# Altium schematic sheet Э4.SchDoc
size A3
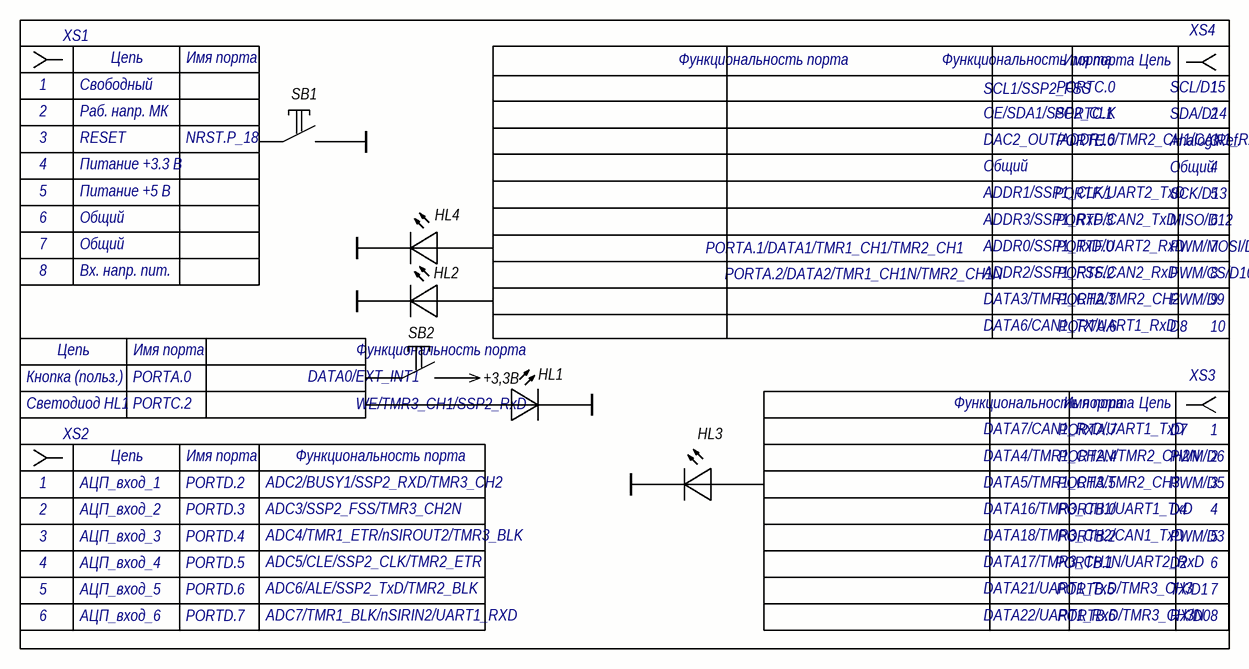
[diagram p0: Э4.SchDoc]

## Parts
(Parts that share a designator on the sheet are numbered #1, #2 ... from top to bottom, then left to right.)
HL1  Светодиод  [DIODE: LED3MM_G]  (value not drawn)
HL2  Светодиод  [DIODE: LED3MM_G]  (value not drawn)
HL3  Светодиод  [DIODE: LED3MM_G]  (value not drawn)
HL4  Светодиод  [DIODE: LED3MM_G]  (value not drawn)
SB?#1  Переключатель  [BUT: 6x6 SMD]  (value not drawn)  (part A of 2)
SB?#2  Переключатель  [BUT: 6x6 SMD]  (value not drawn)  (part A of 2)

## Nets
+3,3В: SB?#2.2
GND: HL1.K HL2.K HL3.K HL4.K SB?#1.2

Not connected (* = marked no-connect by the designer): HL1 A; HL2 A; HL3 A; HL4 A; SB?#1 1; SB?#2 1

## Notes on the sheet
- 1
- XS1
- Свободный
- Цепь
- Имя порта
- (near SB?#1) SB1
- Функциональность порта
- SCL1/SSP2_FSS
- PORTC.0
- SCL/D15
- XS4
- 2
- 3
- Раб. напр. МК
- RESET
- (near SB?#1) NRST.P_18
- OE/SDA1/SSP2_CLK
- DAC2_OUT/ADDR16/TMR2_CH1/CAN1_RхD
- PORTC.1
- PORTE.0
- SDA/D14
- Analog Ref.
- 4
- 5
- 6
- Питание +3.3 В
- Питание +5 В
- Общий
- ADDR1/SSP1_CLK/UART2_TxD
- ADDR3/SSP1_RxD/CAN2_TxD
- PORTF.1
- PORTF.3
- SCK/D13
- MISO/D12
- 7
- 8
- Вх. напр. пит.
- (near HL4) PORTA.1/DATA1/TMR1_CH1/TMR2_CH1
- PORTA.2/DATA2/TMR1_CH1N/TMR2_CH1N
- ADDR0/SSP1_TxD/UART2_RxD
- ADDR2/SSP1_FSS/CAN2_RxD
- PORTF.0
- PORTF.2
- PWM/MOSI/D11
- PWM/CS/D10
- SB2
- DATA3/TMR1_CH2/TMR2_CH2
- DATA6/CAN1_TX/UART1_RxD
- PORTA.3
- PORTA.6
- PWM/D9
- D8
- 9
- 10
- Кнопка (польз.)
- Светодиод HL1
- PORTA.0
- PORTС.2
- DATA0/EXT_INT1
- (near SB?#2) WE/TMR3_CH1/SSP2_RxD
- DATA7/CAN1_RxD/UART1_TxD
- PORTA.7
- D7
- XS3
- XS2
- АЦП_вход_1
- PORTD.2
- ADC2/BUSY1/SSP2_RXD/TMR3_CH2
- DATA4/TMR1_CH2N/TMR2_CH2N
- DATA5/TMR1_CH3/TMR2_CH3
- PORTA.5
- PORTA.4
- PWM/D6
- PWM/D5
- АЦП_вход_2
- АЦП_вход_3
- АЦП_вход_4
- PORTD.3
- PORTD.4
- PORTD.5
- ADC3/SSP2_FSS/TMR3_CH2N
- ADC4/TMR1_ETR/nSIROUT2/TMR3_BLK
- ADC5/CLE/SSP2_CLK/TMR2_ETR
- DATA16/TMR3_CH1/UART1_TxD
- DATA18/TMR3_CH2/CAN1_TxD
- DATA17/TMR3_CH1N/UART2_RxD
- PORTB.1
- PORTB.0
- PORTB.2
- D4
- PWM/D3
- D2
- АЦП_вход_5
- АЦП_вход_6
- PORTD.6
- PORTD.7
- ADC6/ALE/SSP2_TxD/TMR2_BLK
- ADC7/TMR1_BLK/nSIRIN2/UART1_RXD
- DATA21/UART1_TxD/TMR3_CH3
- DATA22/UART1_RxD/TMR3_CH3N
- PORTB.5
- PORTB.6
- TX/D1
- RX/D0
- THIS DOCUMENT AND THE DATA DISCLOSED HEREIN OR
- HEREWITH IS THE PROPERTY OF ALTIUM LIMITED AND MAY
- DWG NO:
- REVISION
- REV:
- DESCRIPTION
- DATE
- APPROVED
- BE FREELY DISTRIBUTED IN WHOLE. NO RIGHTS ARE
- RESERVED OR EXPRESS OR IMPLIED WARANTEE GIVEN.
- ENG:
- APPROVALS
- PROJECT
- DSN:
- CHK:
- REFERENCE DOCUMENTS
- PROJECT REVISION:
- TITLE
- DOCUMENT REVISION:
- DESIGN ITEM:
- BOM:
- FAB DWG:
- PCB DWG:
- ASSY DWG:
- SCALE:
- A3
- SIZE
- CAGE CODE
- FILE NAME
- DWG NO.
- SHEET
- OF
- REV

## Library data of the parts
HL1-HL4 = Светодиоды: Betlux Electronics; TU/GOST: Фирма "Betlux Electronics"; Value: 2.1 V; Model: BL-L2506URC; Product Code: 63 1000; Published: 24-Mar-1999; LatestRevisionDate: 17-Jul-2002; LatestRevisionNote: Re-released for DXP Platform.; PackageReference: PIN2; Publisher: Altium Limited; Distributer: АО "Чип и Дип"; Category: Светодиод; Component Name: BL-L2506URC
SB?#1 SB?#2 = BT-02x-01p_S: фирма KLS electronic co ltd; Product Code: 34 6422; Component Name: KLS7-TS6604-7.0-180-B(Т); Published: 17.04.2014; Publisher: Andrew Danich; Type: Переключатель; TU/GOST: фирма KLS electronic co ltd; Distributer: ЗАО "Чип и Дип"